# Altium schematic sheet interface.SchDoc (part 2 of 2)
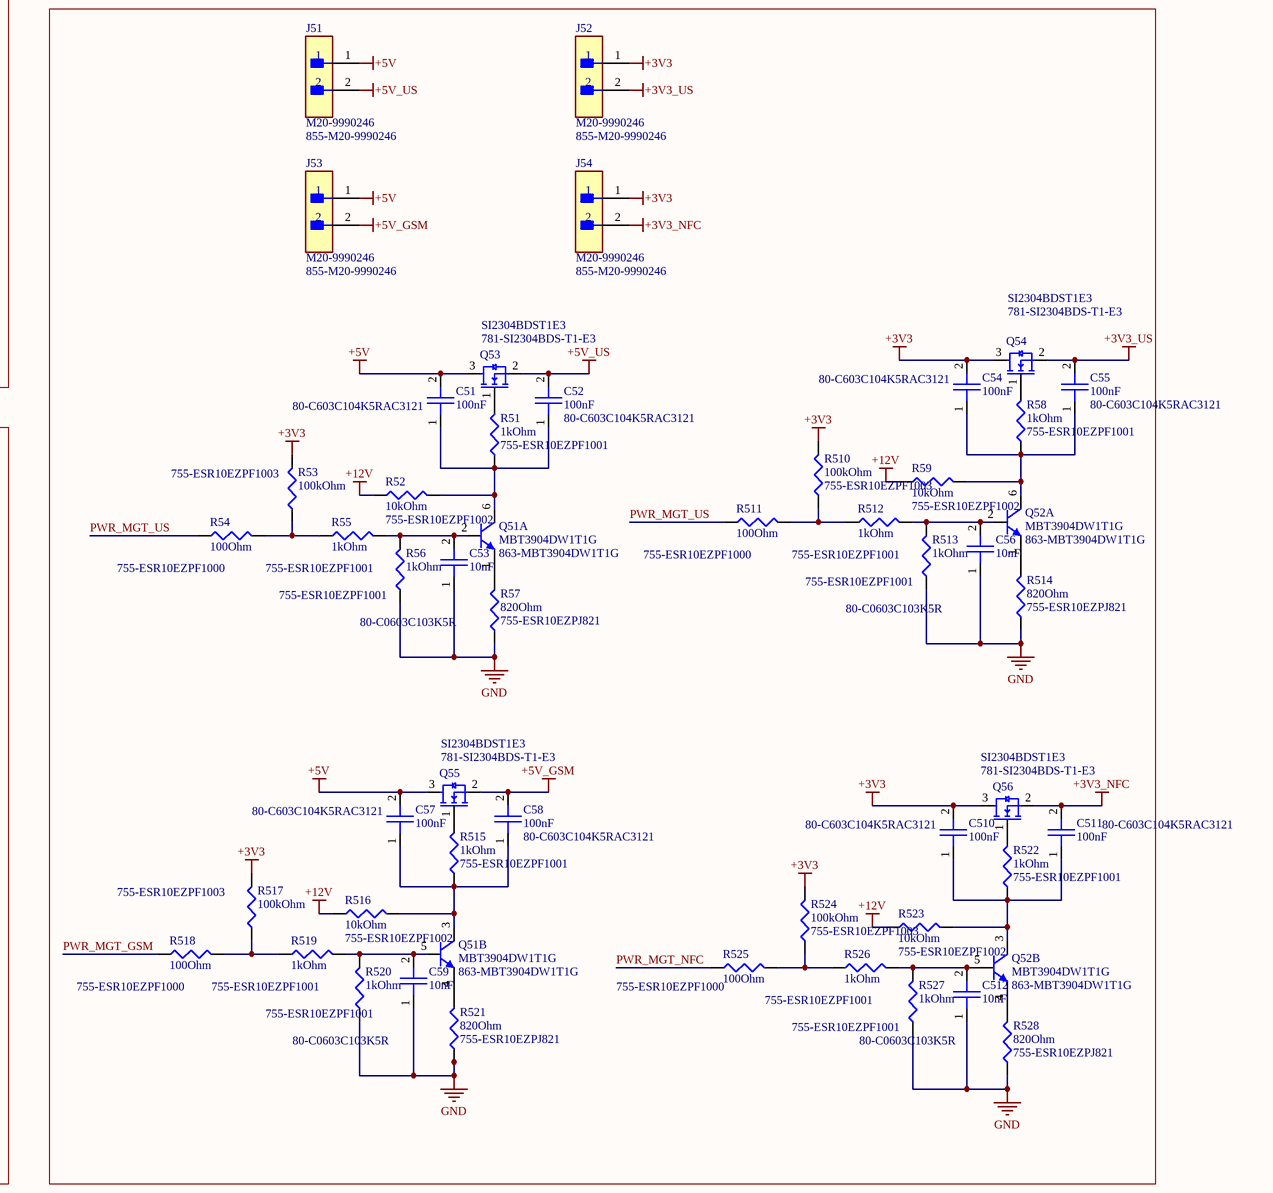
[diagram p4: interface.SchDoc, bottom right]

## Notes on the sheet
- (in symbol AP62301WU-7) GND; BST; SW; EN; VIN; FB
- (in symbol SN74LV1T02DBVRG4) A; B

## Library data of the parts
C11 C32 C53 C56 C59 C512 = C0603C103K5RACTU: CAP CER 10000PF 50V X7R 0603; Manufacturer: KEMET; Dielectric Material: Ceramic; Tolerance: 10%; Dissipation Factor: 2.5%; Supplier 1: Mouser; Manufacturer Part Number: C0603C103K5RACTU; RoHS: Yes; Category: Ceramic Capacitors; Stock 1: 1844699; Pricing 1: 1=0,16000, 10=0,07400, 50=0,07400, 100=0,03300, 500=0,02400, 1000=0,01900, 2000=0,01700, 4000=0,01500, 8000=0,01300, 10000=0,01300 (USD); Mount: Surface Mount,PCB; Case/Package: 0603; Number of Pins: 2; Case Code (Metric): 1608; Case Code (Imperial): 0603; Contact Plating: Tin,Matte; Min Operating Temperature: -55°C; Max Operating Temperature: 125°C; Capacitance: 10nF; Dielectric: X7R; Voltage Rating: 50V; Voltage Rating (DC): 50V; Packaging: Tape and Reel; Package Quantity: 4000; Termination: SMD/SMT; Voltage: 50V; Series: C0603C; Construction: Flat; Length: 1.6mm; Width: 0.8mm; Height: 0.8mm; Thickness: 0.034inch; Lead Pitch: 0.7mm; Depth: 0.8mm; Radiation Hardening: No; REACH SVHC: No SVHC; RoHS Compliant: Yes; ComponentLink1URL: https://datasheet.ciiva.com/7823/1732718-7823585.pdf?src-supplier=Element14; ComponentLink1Description: https://datasheet.ciiva.com/7823/1732718-7823585.pdf?src-supplier=Element14; ComponentLink2URL: https://datasheet.ciiva.com/5904/kem-c1002-x7r-smd-5904645.pdf?src-supplier=Farnell; ComponentLink2Description: https://datasheet.ciiva.com/5904/kem-c1002-x7r-smd-5904645.pdf?src-supplier=Farnell; ComponentLink3URL: https://datasheet.ciiva.com/7823/kem-c1002-x7r-smd-7823976.pdf?src-supplier=Element14; ComponentLink3Description: https://datasheet.ciiva.com/7823/kem-c1002-x7r-smd-7823976.pdf?src-supplier=Element14; ComponentLink4URL: https://datasheet.ciiva.com/7823/1918693-7823978.pdf?src-supplier=Element14; ComponentLink4Description: https://datasheet.ciiva.com/7823/1918693-7823978.pdf?src-supplier=Element14; ComponentLink5URL: https://datasheet.ciiva.com/28645/1851736-28645598.pdf?src-supplier=Element14; ComponentLink5Description: https://datasheet.ciiva.com/28645/1851736-28645598.pdf?src-supplier=Element14; ComponentLink6URL: https://datasheet.ciiva.com/7823/kem-c1002-x7r-smd-7823977.pdf?src-supplier=Element14; ComponentLink6Description: https://datasheet.ciiva.com/7823/kem-c1002-x7r-smd-7823977.pdf?src-supplier=Element14; ComponentLink7URL: https://datasheet.ciiva.com/14585/70095383-14585450.pdf?src-supplier=Allied+Electronics; ComponentLink7Description: https://datasheet.ciiva.com/14585/70095383-14585450.pdf?src-supplier=Allied+Electronics; ComponentLink8URL: https://datasheet.ciiva.com/5416/kem-c1002-x7r-smd-5416028.pdf?src-supplier=Mouser; ComponentLink8Description: https://datasheet.ciiva.com/5416/kem-c1002-x7r-smd-5416028.pdf?src-supplier=Mouser; ComponentLink9URL: https://datasheet.ciiva.com/39122/kem-c1002-x7r-smd-39122903.pdf?src-supplier=Onlinecomponents.com; ComponentLink9Description: https://datasheet.ciiva.com/39122/kem-c1002-x7r-smd-39122903.pdf?src-supplier=Onlinecomponents.com; ComponentLink10URL: https://datasheet.ciiva.com/18192/getdatasheetpartid-308803-18192662.pdf?src-supplier=Verical; ComponentLink10Description: https://datasheet.ciiva.com/18192/getdatasheetpartid-308803-18192662.pdf?src-supplier=Verical; ComponentLink11URL: https://datasheet.ciiva.com/18101/getdatasheetpartid-58468-18101898.pdf?src-supplier=Verical; ComponentLink11Description: https://datasheet.ciiva.com/18101/getdatasheetpartid-58468-18101898.pdf?src-supplier=Verical
C12 C21-C24 C33 C51 C52 C54 C55 C57 C58 C63 C510 C511 = C0603C104K5RAC3121: Cap Ceramic 0.1uF 50V X7R 10% Pad SMD 0603 125°C T/R; Manufacturer: KEMET; Supplier 1: Mouser; Manufacturer Part Number: C0603C104K5RAC3121; RoHS: Yes; Category: Ceramic Capacitors; Stock 1: 3306727; Pricing 1: 1=0,13000, 10=0,09200, 50=0,09200, 100=0,04300, 1000=0,02500, 10000=0,01900 (USD); Case/Package: 0603; RoHS Compliant: Yes
C13 C34 = C0603C105K4RACTU: Cap Ceramic 1uF 16V X7R 10% SMD 0603 125°C Paper T/R; Manufacturer: KEMET; Dissipation Factor: 3.5%; Supplier 1: Mouser; Manufacturer Part Number: C0603C105K4RACTU; RoHS: Yes; Category: Ceramic Capacitors; Stock 1: 3280807; Pricing 1: 1=0,17000, 10=0,08000, 50=0,08000, 100=0,03600, 500=0,02600, 1000=0,02000, 2000=0,01900, 4000=0,01600, 8000=0,01400, 10000=0,01400 (USD); Mount: Surface Mount,PCB; Case/Package: 0603; Number of Pins: 2; Case Code (Metric): 1608; Case Code (Imperial): 0603; Contact Plating: Tin,Matte; Dielectric Material: Ceramic; Min Operating Temperature: -55°C; Max Operating Temperature: 125°C; Package Quantity: 4000; Capacitance: 1uF; Voltage Rating: 16V; Tolerance: 10%; Packaging: Tape and Reel; Voltage Rating (DC): 16V; Dielectric: X7R; Termination: SMD/SMT; Voltage: 16V; Series: C0603C; Construction: Flat; Length: 1.6mm; Width: 0.031inch; Height: 0.8mm; Thickness: 0.034inch; Depth: 0.8mm; Radiation Hardening: No; REACH SVHC: No SVHC; RoHS Compliant: Yes; ComponentLink1URL: https://datasheet.ciiva.com/7823/kem-c1002-x7r-smd-7823997.pdf?src-supplier=Element14; ComponentLink1Description: https://datasheet.ciiva.com/7823/kem-c1002-x7r-smd-7823997.pdf?src-supplier=Element14; ComponentLink2URL: https://datasheet.ciiva.com/22749/kem-c1002-x7r-smd-22749721.pdf?src-supplier=Element14; ComponentLink2Description: https://datasheet.ciiva.com/22749/kem-c1002-x7r-smd-22749721.pdf?src-supplier=Element14; ComponentLink3URL: https://datasheet.ciiva.com/5419/kem-c1002-x7r-smd-5419750.pdf?src-supplier=Mouser; ComponentLink3Description: https://datasheet.ciiva.com/5419/kem-c1002-x7r-smd-5419750.pdf?src-supplier=Mouser; ComponentLink4URL: https://datasheet.ciiva.com/18192/getdatasheetpartid-385479-18192732.pdf?src-supplier=Verical; ComponentLink4Description: https://datasheet.ciiva.com/18192/getdatasheetpartid-385479-18192732.pdf?src-supplier=Verical
C31 = C0603C124K5RACTU: 0603 C 120nF Ceramic Multilayer Capacitor; 50 V; +125degC; X7R Dielec; +/-10%; Manufacturer: KEMET; Tolerance: 10%; Voltage Rating: 50V; Supplier 1: Mouser; Manufacturer Part Number: C0603C124K5RACTU; RoHS: Yes; Category: Ceramic Capacitors; Stock 1: 90207; Pricing 1: 1=0,37000, 10=0,18700, 50=0,18700, 100=0,15600, 500=0,11800, 1000=0,10300, 4000=0,09000, 8000=0,08200, 10000=0,08200, 12000=0,08100 (USD); Case/Package: 0603; Number of Pins: 2; Case Code (Metric): 1608; Case Code (Imperial): 0603; Dielectric Material: Ceramic; Min Operating Temperature: -55°C; Max Operating Temperature: 125°C; Packaging: Cut Tape; Capacitance: 120nF; Dielectric: X7R; Voltage: 50V; Termination: SMD/SMT; Voltage Rating (DC): 50V; Package Quantity: 1; Series: C; Construction: Flat; Length: 1.6mm; Width: 0.031inch; Height: 0.8mm; Depth: 0.8mm; Thickness: 0.034inch; Radiation Hardening: No; REACH SVHC: No SVHC; RoHS Compliant: Yes; ComponentLink1URL: https://datasheet.ciiva.com/7823/1633156-7823623.pdf?src-supplier=Element14; ComponentLink1Description: https://datasheet.ciiva.com/7823/1633156-7823623.pdf?src-supplier=Element14; ComponentLink2URL: https://datasheet.ciiva.com/22693/1851736-22693982.pdf?src-supplier=Element14; ComponentLink2Description: https://datasheet.ciiva.com/22693/1851736-22693982.pdf?src-supplier=Element14
C61 = EMK316BJ106KL8T: Capacitor Ceramic 10uF 16V X5R 10% SMD 1206 85°C Embossed T/R; Manufacturer: Taiyo Yuden; Manufacturer Part Number: EMK316BJ106KL8T; RoHS: Yes; Category: Ceramic Capacitors; Stock 1: 6028; Pricing 1: 1=0,42000, 10=0,29200, 50=0,29200, 100=0,17500, 1000=0,12800, 10000=0,09300 (USD); Supplier 1: Mouser
C621 C622 = EMK316BJ226KL-T: Cap Ceramic 22uF 16V X7R 10% SMD 0805 125°C Paper T/R; Manufacturer: Taiyo Yuden; Dielectric: X5R; Supplier 1: Mouser; Manufacturer Part Number: EMK316BJ226KL-T; RoHS: Yes; Category: Ceramic Capacitors; Stock 1: 61956; Pricing 1: 1=0,47000, 10=0,34700, 50=0,34700, 100=0,24600, 1000=0,17300, 10000=0,15000 (USD); Mount: Surface Mount; Case/Package: 1206; Case Code (Imperial): 1206; Case Code (Metric): 3216; Min Operating Temperature: -55°C; Max Operating Temperature: 85°C; Tolerance: 10%; Packaging: Tape and Reel; Voltage Rating: 16V; Capacitance: 22uF; Voltage Rating (DC): 16V; Package Quantity: 2000; Termination: SMD/SMT; Resistor Type: Ceramic; Series: M; Construction: Flat; Length: 0.126inch; Width: 1.6mm; Height: 1.6mm; Thickness: 0.071inch; RoHS Compliant: Yes; ComponentLink1URL: https://datasheet.ciiva.com/30123/emultilayer-ceramic-capacitor-30123646.pdf?src-supplier=Onlinecomponents.com; ComponentLink1Description: https://datasheet.ciiva.com/30123/emultilayer-ceramic-capacitor-30123646.pdf?src-supplier=Onlinecomponents.com
D1 D4 = LTST-C193TGKT-5A: 0603(H=0.35mm) 绿色 λD=520nm~535nm VR=5V VF=2.5V~3.1V IF=5mA PD=76mW; Manufacturer: Vishay Lite-On; Color: Green; Lens Color: Colorless; Forward Current: 5mA; Forward Voltage: 3.1V; Luminous Intensity: 280mcd; Viewing Angle: 130°; Lens Style: Diffused,Colorless,Rectangular; Lens Transparency: Clear; Dominant Wavelength: 535nm; Number of Elements: 1; Power Dissipation: 76mW; Reverse Voltage: 5V; Supplier 1: Mouser; Manufacturer Part Number: LTST-C193TGKT-5A; RoHS: Yes; Category: LEDs; Stock 1: 78292; Pricing 1: 1=0,44000, 10=0,27500, 50=0,27500, 100=0,15800, 1000=0,12400, 5000=0,11300, 10000=0,09600, 25000=0,09200, 50000=0,08900 (USD); Mount: Surface Mount; Case/Package: 0603; Number of Pins: 2; Case Code (Metric): 1608; Case Code (Imperial): 0603; Min Operating Temperature: -20°C; Max Operating Temperature: 80°C; Illumination Color: Green; Packaging: Tape and Reel; Package Quantity: 3000; Test Current: 5mA; Number of LEDs: 1; Series: -; Length: 1.6mm; Width: 0.8mm; Height: 0.35mm; Depth: 0.8mm; Radiation Hardening: No; Lead Free: Lead Free; RoHS Compliant: Yes; ComponentLink1URL: https://datasheet.ciiva.com/2111/ltst-c193tgkt-5a-2111818.pdf?src-supplier=Digi-Key; ComponentLink1Description: https://datasheet.ciiva.com/2111/ltst-c193tgkt-5a-2111818.pdf?src-supplier=Digi-Key; ComponentLink2URL: https://datasheet.ciiva.com/11775/0900766b80dc0555-11775617.pdf?src-supplier=RSComponents; ComponentLink2Description: https://datasheet.ciiva.com/11775/0900766b80dc0555-11775617.pdf?src-supplier=RSComponents; ComponentLink3URL: https://datasheet.ciiva.com/4689/lite-on-ltst-c193tgkt-5a-187259-4689610.pdf?src-supplier=Mouser; ComponentLink3Description: https://datasheet.ciiva.com/4689/lite-on-ltst-c193tgkt-5a-187259-4689610.pdf?src-supplier=Mouser; ComponentLink4URL: https://datasheet.ciiva.com/2111/p-100-ltst-c193tgkt-5a-2111819.pdf?src-supplier=Digi-Key; ComponentLink4Description: https://datasheet.ciiva.com/2111/p-100-ltst-c193tgkt-5a-2111819.pdf?src-supplier=Digi-Key; ComponentLink5URL: https://datasheet.ciiva.com/2111/p-100-ltst-c193tgkt-5a-2111820.pdf?src-supplier=Digi-Key; ComponentLink5Description: https://datasheet.ciiva.com/2111/p-100-ltst-c193tgkt-5a-2111820.pdf?src-supplier=Digi-Key
D2 = LTST-C193TBKT-5A: 0603(H=0.35mm) 蓝色 λD=465nm~475nm VR=5V VF=2.65V~3.05V IF=5mA PD=76mW; Manufacturer: Vishay Lite-On; Color: Blue; Lens Color: Colorless; Forward Current: 20mA; Forward Voltage: 2.8V; Luminous Intensity: 15mcd; Viewing Angle: 130°; Lens Style: Diffused,Colorless,Rectangular,Clear; Dominant Wavelength: 475nm; Test Current: 5mA; Lens Transparency: Clear; Number of Elements: 1; Power Dissipation: 76mW; Reverse Voltage: 5V; Supplier 1: Mouser; Manufacturer Part Number: LTST-C193TBKT-5A; RoHS: Yes; Category: LEDs; Stock 1: 327691; Pricing 1: 1=0,30000, 10=0,23400, 50=0,23400, 100=0,10600, 500=0,09500, 1000=0,07800, 5000=0,06700, 10000=0,05400, 25000=0,05000, 50000=0,04500 (USD); Mount: Surface Mount; Case/Package: 0603; Number of Pins: 2; Case Code (Metric): 1608; Case Code (Imperial): 0603; Min Operating Temperature: -20°C; Max Operating Temperature: 80°C; Illumination Color: Blue; Packaging: Tape and Reel; Package Quantity: 1; Number of LEDs: 1; Length: 1.6mm; Width: 0.8mm; Height: 0.35mm; Depth: 0.8mm; Radiation Hardening: No; RoHS Compliant: Yes; Lead Free: Lead Free; ComponentLink1URL: https://datasheet.ciiva.com/2111/ltst-c193tbkt-5a-2111219.pdf?src-supplier=Digi-Key; ComponentLink1Description: https://datasheet.ciiva.com/2111/ltst-c193tbkt-5a-2111219.pdf?src-supplier=Digi-Key; ComponentLink2URL: https://datasheet.ciiva.com/11773/0900766b80dc0554-11773880.pdf?src-supplier=RSComponents; ComponentLink2Description: https://datasheet.ciiva.com/11773/0900766b80dc0554-11773880.pdf?src-supplier=RSComponents; ComponentLink3URL: https://datasheet.ciiva.com/4688/lite-on-ltst-c193tbkt-5a-187386-4688832.pdf?src-supplier=Mouser; ComponentLink3Description: https://datasheet.ciiva.com/4688/lite-on-ltst-c193tbkt-5a-187386-4688832.pdf?src-supplier=Mouser; ComponentLink4URL: https://datasheet.ciiva.com/16210/ltst-c193tbkt-5a-16210824.pdf?src-supplier=Future+Electronics; ComponentLink4Description: https://datasheet.ciiva.com/16210/ltst-c193tbkt-5a-16210824.pdf?src-supplier=Future+Electronics; ComponentLink5URL: https://datasheet.ciiva.com/15201/getdatasheetpartid-293056-15201395.pdf?src-supplier=Verical; ComponentLink5Description: https://datasheet.ciiva.com/15201/getdatasheetpartid-293056-15201395.pdf?src-supplier=Verical; ComponentLink6URL: https://datasheet.ciiva.com/2111/p-100-ltst-c193tbkt-5a-2111220.pdf?src-supplier=Digi-Key; ComponentLink6Description: https://datasheet.ciiva.com/2111/p-100-ltst-c193tbkt-5a-2111220.pdf?src-supplier=Digi-Key; ComponentLink7URL: https://datasheet.ciiva.com/2111/p-100-ltst-c193tbkt-5a-2111221.pdf?src-supplier=Digi-Key; ComponentLink7Description: https://datasheet.ciiva.com/2111/p-100-ltst-c193tbkt-5a-2111221.pdf?src-supplier=Digi-Key
D3 = LTST-C191KRKT: 0603(H=0.65mm) 红色 λD=631nm VR=5V VF=2.0V~2.4V IF=20mA PD=75mW; Manufacturer: Vishay Lite-On; Color: Red; Lens Color: Colorless; Luminous Intensity: 54mcd; Viewing Angle: 130°; Forward Current: 30mA; Forward Voltage: 2V; Lens Style: Clear,Diffused,Colorless,Rectangular; Dominant Wavelength: 631nm; Test Current: 20mA; Lens Transparency: Clear; Number of Elements: 1; Power Dissipation: 75mW; Wavelength: 639nm; Reverse Voltage: 5V; Supplier 1: Mouser; Manufacturer Part Number: LTST-C191KRKT; RoHS: Yes; Category: LEDs; Stock 1: 594160; Pricing 1: 1=0,26000, 10=0,14200, 50=0,14200, 100=0,06600, 500=0,06100, 1000=0,04800, 5000=0,04600, 10000=0,03600, 25000=0,03200, 50000=0,02900 (USD); Mount: Surface Mount; Case/Package: 0603; Number of Pins: 2; Case Code (Metric): 1608; Case Code (Imperial): 0603; Min Operating Temperature: -55°C; Max Operating Temperature: 85°C; Packaging: Tape and Reel; Package Quantity: 1; Illumination Color: Red; Number of LEDs: 1; Power Rating: 75mW; Length: 1.6mm; Width: 0.8mm; Height: 0.55mm; Depth: 0.8mm; Radiation Hardening: No; RoHS Compliant: Yes; Lead Free: Lead Free; ComponentLink1URL: https://datasheet.ciiva.com/11773/0900766b80dc02b2-11773601.pdf?src-supplier=RSComponents; ComponentLink1Description: https://datasheet.ciiva.com/11773/0900766b80dc02b2-11773601.pdf?src-supplier=RSComponents; ComponentLink2URL: https://datasheet.ciiva.com/12400/lite-on-ltst-c191krkt-190135-12400910.pdf?src-supplier=Mouser; ComponentLink2Description: https://datasheet.ciiva.com/12400/lite-on-ltst-c191krkt-190135-12400910.pdf?src-supplier=Mouser; ComponentLink3URL: https://datasheet.ciiva.com/16212/ltst-c191krkt-16212419.pdf?src-supplier=Future+Electronics; ComponentLink3Description: https://datasheet.ciiva.com/16212/ltst-c191krkt-16212419.pdf?src-supplier=Future+Electronics; ComponentLink4URL: https://datasheet.ciiva.com/15117/getdatasheetpartid-141922-15117737.pdf?src-supplier=Verical; ComponentLink4Description: https://datasheet.ciiva.com/15117/getdatasheetpartid-141922-15117737.pdf?src-supplier=Verical; ComponentLink5URL: https://datasheet.ciiva.com/2109/s-110-ltst-c191krkt-2109971.pdf?src-supplier=Digi-Key; ComponentLink5Description: https://datasheet.ciiva.com/2109/s-110-ltst-c191krkt-2109971.pdf?src-supplier=Digi-Key; ComponentLink6URL: https://datasheet.ciiva.com/2109/s-110-ltst-c191krkt-2109970.pdf?src-supplier=Digi-Key; ComponentLink6Description: https://datasheet.ciiva.com/2109/s-110-ltst-c191krkt-2109970.pdf?src-supplier=Digi-Key; ComponentLink7URL: https://datasheet.ciiva.com/2109/s-110-ltst-c191krkt-2109972.pdf?src-supplier=Digi-Key; ComponentLink7Description: https://datasheet.ciiva.com/2109/s-110-ltst-c191krkt-2109972.pdf?src-supplier=Digi-Key; Voltage: 2V
J01 = CON-SOCJ-2155: DC Power Connectors Power Jack/Connector 2.1mm x 5.5mm; Manufacturer: Gravitech; Supplier 1: Mouser; Manufacturer Part Number: CON-SOCJ-2155; RoHS: Yes; Category: Uncategorized; Stock 1: 14426; Pricing 1: 1=1,00000, 10=1,00000, 50=1,00000, 100=1,00000, 1000=1,00000, 10000=1,00000 (USD); Color: Black; Connector Type: Power; Contact Gender: Female; ComponentLink1URL: http://www.gravitech.us/poja2x51.html?src-supplier=Mouser; ComponentLink1Description: http://www.gravitech.us/poja2x51.html?src-supplier=Mouser
J11 J12 = TFM-110-21-S-D: SAMTEC         TFM-110-21-S-D             Board-To-Board Connector, TFM Series, 20 Contacts, Header, 1.27 mm, Through Hole, 2 Rows; Max Current Rating: 5A; Number of Contacts: 20; Max Voltage Rating (AC): 350V; Gender: Male; Pitch: 1.27mm; Supplier 1: Mouser; Manufacturer: Samtec; Manufacturer Part Number: TFM-110-21-S-D; RoHS: Yes; Category: Connectors; Stock 1: 11; Pricing 1: 1=7,99000, 10=7,65000, 50=7,65000, 100=7,65000, 1000=5,32000, 10000=4,66000 (USD); Housing Color: Black; Housing Material: Polymer; Contact Plating: Gold; Contact Material: Bronze; Min Operating Temperature: -55°C; Max Operating Temperature: 125°C; Packaging: Rail/Tube; Number of Rows: 2; Termination: Solder; Orientation: Straight; Length: 15.88mm; Depth: 5.72mm; REACH SVHC: No SVHC; RoHS Compliant: Yes; ComponentLink1URL: http://www.farnell.com/datasheets/2047776.pdf?src-supplier=Farnell; ComponentLink1Description: http://www.farnell.com/datasheets/2047776.pdf?src-supplier=Farnell; ComponentLink2URL: http://www.samtec.com/documents/webfiles/pdf/TFM_SM.PDF?src-supplier=Avnet; ComponentLink2Description: http://www.samtec.com/documents/webfiles/pdf/TFM_SM.PDF?src-supplier=Avnet
J13 = PPTC071LFBN-RC: Female, 7C, Straight, .100"CC; 3.20mm Tail, No Mt. 100u" Tin; PBT, Phos Bronze, 105 C; Manufacturer: Sullins; Number of Positions: 7; Connector Type: Header,Socket; Pitch: 0.1inch; Supplier 1: Digi-Key; Manufacturer Part Number: PPTC071LFBN-RC; RoHS: Yes; Category: Connectors; Stock 1: 23266; Pricing 1: 1=0,59000, 10=0,51500, 80=0,42438, 440=0,36900, 1000=0,30442, 5000=0,26752, 10000=0,26650 (USD); Mount: Through Hole; Contact Material: Bronze; Contact Plating: Tin; Color: Black; Housing Material: Plastic; Termination: Solder; Package Quantity: 1000; Number of Rows: 1; Packaging: Bulk; Length: 18.3mm; Width: 2.5mm; Height: 8.5mm; Lead Free: Lead Free; ComponentLink1URL: https://media.digikey.com/pdf/Data%20Sheets/Sullins%20PDFs/Female_Headers.100_DS.pdf?src-supplier=Digi-Key; ComponentLink1Description: https://media.digikey.com/pdf/Data%20Sheets/Sullins%20PDFs/Female_Headers.100_DS.pdf?src-supplier=Digi-Key; ComponentLink2URL: http://www.sullinscorp.com/catalogs/78_Page80-81_HEADER_.100_2.54mm_FEMALE.pdf?src-supplier=Future+Electronics; ComponentLink2Description: http://www.sullinscorp.com/catalogs/78_Page80-81_HEADER_.100_2.54mm_FEMALE.pdf?src-supplier=Future+Electronics
J14 J26 J34 = 61301221021: THT Angled Pin Header WR-PHD, Pitch 2.54 mm, Dual Row, 12 pins; Manufacturer: Wurth Elektronik; Pitch: 2.54mm; Gender: Male; Pin Number: 12; Working Voltage: 250VAC; Withstanding Voltage: 500VAC; Contact Resistance: 20mOhm; Rated Current: 3A; Datasheet URL: https://katalog.we-online.de/em/datasheet/6130xx21021.pdf; Orientation: Angled; Package Reference: 61301221021; Operating Temperature: -40to105degC; Part Number: 61301221021; Mounting Technology: THT; Row Number: Dual; Publisher: WurthElektronik; Packaging: Bag; Manufacturer URL: http://www.we-online.de; Supplier 1: Mouser
J21-J25 J33 = PPPC041LFBN-RC: 4 Positions Embase Connecteur 0,100 po (2,54mm) Trou traversant Or; Manufacturer: Sullins; Number of Positions: 4; Pitch: 0.1inch; Supplier 1: Digi-Key; Manufacturer Part Number: PPPC041LFBN-RC; RoHS: Yes; Category: Connectors; Stock 1: 100451; Pricing 1: 1=0,47000, 10=0,40700, 100=0,33530, 500=0,29160, 1000=0,24057, 5000=0,21141, 10000=0,21060 (USD); Mount: Through Hole; Color: Black; Contact Plating: Gold; Contact Material: Bronze; Housing Material: Plastic; Package Quantity: 1000; Number of Rows: 1; Packaging: Bulk; Termination: Solder; Connector Type: Header; Contact Type: Female Socket; Length: 10.7mm; Width: 2.5mm; Height: 8.5mm; Lead Free: Lead Free; RoHS Compliant: Yes; ComponentLink1URL: https://media.digikey.com/pdf/Data%20Sheets/Sullins%20PDFs/Female_Headers.100_DS.pdf?src-supplier=Digi-Key; ComponentLink1Description: https://media.digikey.com/pdf/Data%20Sheets/Sullins%20PDFs/Female_Headers.100_DS.pdf?src-supplier=Digi-Key; ComponentLink2URL: http://www.sullinscorp.com/catalogs/78_Page80-81_HEADER_.100_2.54mm_FEMALE.pdf?src-supplier=Future+Electronics; ComponentLink2Description: http://www.sullinscorp.com/catalogs/78_Page80-81_HEADER_.100_2.54mm_FEMALE.pdf?src-supplier=Future+Electronics
J31 = PPTC061LFBN-RC: Female, 6 C, Straight, .100"CC; 3.20mm Tail, No Mt. 100u" Tin; PBT, Phos Bronze, 105 C; Manufacturer: Sullins; Supplier 1: Digi-Key; Manufacturer Part Number: PPTC061LFBN-RC; RoHS: Yes; Category: Connectors; Stock 1: 131305; Pricing 1: 1=0,52000, 10=0,44900, 80=0,37050, 440=0,32220, 1000=0,26582, 5000=0,23360, 10000=0,23270 (USD); ComponentLink1URL: https://media.digikey.com/pdf/Data%20Sheets/Sullins%20PDFs/Female_Headers.100_DS.pdf?src-supplier=Digi-Key; ComponentLink1Description: https://media.digikey.com/pdf/Data%20Sheets/Sullins%20PDFs/Female_Headers.100_DS.pdf?src-supplier=Digi-Key; ComponentLink2URL: http://www.sullinscorp.com/catalogs/78_Page80-81_HEADER_.100_2.54mm_FEMALE.pdf?src-supplier=Future+Electronics; ComponentLink2Description: http://www.sullinscorp.com/catalogs/78_Page80-81_HEADER_.100_2.54mm_FEMALE.pdf?src-supplier=Future+Electronics
J32 = 110990030: Grove - Universal 4 pin connector [Seeed Studio] 110990030 Grove - Universal 4 pin connector; Supplier 1: Digi-Key; Manufacturer: Seeed Studio; Manufacturer Part Number: 110990030; RoHS: No; Category: Connectors; Stock 1: 3588; Pricing 1: 1=1,70000 (USD); ComponentLink1URL: http://www.mouser.com/ds/2/744/Seeed_316010005-786598.pdf?src-supplier=Mouser; ComponentLink1Description: http://www.mouser.com/ds/2/744/Seeed_316010005-786598.pdf?src-supplier=Mouser; ComponentLink2URL: https://statics3.seeedstudio.com/images/opl/datasheet/3470130P1.pdf?src-supplier=Digi-Key; ComponentLink2Description: https://statics3.seeedstudio.com/images/opl/datasheet/3470130P1.pdf?src-supplier=Digi-Key
J51-J54 = M20-9990246: 2.54mm (0.1") Pitch SIL Vertical PC Tail Pin Header, 6.1mm mating pin height, tin, 2 contacts; Manufacturer: Harwin; Number of Contacts: 2; Current Rating: 3A; Contact Resistance: 30mR; Gender: Male; Insulation Resistance: 10GR; Voltage Rating (AC): 750V; Connector Type: Male Pin; Supplier 1: Mouser; Manufacturer Part Number: M20-9990246; RoHS: Yes; Category: Headers and Wire Housings; Stock 1: 121083; Pricing 1: 1=0,17000, 10=0,08400, 50=0,08400, 100=0,07000, 500=0,06300, 1000=0,05400, 2000=0,04600, 10000=0,04500, 25000=0,03700, 50000=0,03500 (USD); Mount: Through Hole; Case/Package: SIL; Contact Plating: Tin; Color: Black; Contact Material: Brass,Bronze; Housing Color: Black; Housing Material: Nylon; Min Operating Temperature: -40°C; Max Operating Temperature: 105°C; Number of Rows: 1; Termination: Solder; Package Quantity: 1000; Packaging: Bulk; Max Current Rating: 3A; Number of Positions: 2; Orientation: Straight; Length: 5.08mm; Pitch: 2.54mm; Contact Mating Length: 0.24inch; Depth: 2.54mm; Radiation Hardening: No; REACH SVHC: No SVHC; ComponentLink1URL: https://datasheet.ciiva.com/8046/315376-8046930.pdf?src-supplier=Element14; ComponentLink1Description: https://datasheet.ciiva.com/8046/315376-8046930.pdf?src-supplier=Element14; ComponentLink2URL: https://datasheet.ciiva.com/11745/0900766b81034e61-11745755.pdf?src-supplier=RSComponents; ComponentLink2Description: https://datasheet.ciiva.com/11745/0900766b81034e61-11745755.pdf?src-supplier=RSComponents; ComponentLink3URL: https://datasheet.ciiva.com/22660/1830818-22660571.pdf?src-supplier=Element14; ComponentLink3Description: https://datasheet.ciiva.com/22660/1830818-22660571.pdf?src-supplier=Element14; ComponentLink4URL: https://datasheet.ciiva.com/6833/m20-999-6833368.pdf?src-supplier=Digi-Key; ComponentLink4Description: https://datasheet.ciiva.com/6833/m20-999-6833368.pdf?src-supplier=Digi-Key; ComponentLink5URL: https://datasheet.ciiva.com/26852/getdatasheetpartid-384170-26852203.pdf?src-supplier=Verical; ComponentLink5Description: https://datasheet.ciiva.com/26852/getdatasheetpartid-384170-26852203.pdf?src-supplier=Verical
L61 = SRP7020TA-3R3M: Inductor Power Shielded Wirewound 3.3uH 20% 100KHz 15Q-Factor Metal Alloy Powder 5A 0.048Ohm DCR T/R; Manufacturer: Bourns; Supplier 1: Mouser; Manufacturer Part Number: SRP7020TA-3R3M; RoHS: No; Stock 1: 2936; Pricing 1: 1=1,46000, 10=1,09000, 50=1,09000, 100=0,98300, 250=0,87800, 500=0,75300, 1000=0,66900, 1500=0,64200, 3000=0,59800, 9000=0,56900, 10000=0,56900 (USD)
Q41-Q43 = NXV55UNR: Transistor MOSFET N-Channel 30V 2.3A 3-Pin SOT-23; Manufacturer: Nexperia; Supplier 1: Mouser; Manufacturer Part Number: NXV55UNR; RoHS: No; Stock 1: 55565; Pricing 1: 1=0,45000, 10=0,34400, 50=0,34400, 100=0,19500, 1000=0,09900, 10000=0,06800 (USD)
Q51 Q52 = CMP-1048-00877-1: Dual General Purpose Transistors, 6-Pin SOT-363, Pb-Free, Tape and Reel; Manufacturer: On Semiconductor; Polarity: Dual NPN; fT Min (MHz): 300; IC Continuous (A): 0.2; DatasheetVersion: Rev. 9; ComponentLink2Description: Datasheet; Mounting Technology: Surface Mount; PackageReference: SOT-363-6-419B-02_W; RoHS: TRUE; ComponentLink1Description: Manufacturer URL; ComponentLink2URL: http://www.onsemi.com/pub_link/Collateral/MBT3904DW1T1-D.PDF; PackageVersion: Rev. W, 01/2006; Packing: Tape and Reel; PartNumber: MBT3904DW1T1G; ComponentLink1URL: http://www.onsemi.com/; ComponentLink3URL: http://www.onsemi.com/pub_link/Collateral/NTJD4001N-D.PDF; ComponentLink3Description: Package Specification; PackageDescription: 6-Pin Small Outline Transistor, Body 2 x 1.25 mm, Pitch 0.65 mm; Supplier 1: Mouser
Q53-Q56 = SI2304BDST1E3: Single N-Channel 30 V 0.07 Ohms Surface Mount Power Mosfet - SOT-23; Manufacturer: Vishay; On-State Resistance: 70mR; Rise Time: 12.5ns; Nominal Vgs: 1.5V; Input Capacitance: 225pF; Number of Channels: 1; Max Power Dissipation: 750mW; Drain to Source Voltage (Vdss): 30V; Continuous Drain Current (ID): 2.6A; Gate to Source Voltage (Vgs): 20V; Turn-Off Delay Time: 19ns; Turn-On Delay Time: 7.5ns; Supplier 1: Mouser; Manufacturer Part Number: SI2304BDST1E3; RoHS: Yes; Category: MOSFETs; Stock 1: 13203; Pricing 1: 1=0,67000, 10=0,57800, 50=0,57800, 100=0,43200, 500=0,33900, 1000=0,26200, 3000=0,23800, 10000=0,23800 (USD); Mount: Surface Mount; Case/Package: SOT-23; Number of Pins: 3; Weight: 0.050717oz; Min Operating Temperature: -55°C; Max Operating Temperature: 150°C; Element Configuration: Single; Packaging: Tape and Reel; Package Quantity: 1; Rds On Max: 70mR; Number of Elements: 1; Drain to Source Breakdown Voltage: 30V; Drain to Source Resistance: 70mR; Fall Time: 12.5ns; Threshold Voltage: 1.5V; Power Dissipation: 750mW; Length: 3.04mm; Width: 1.4mm; Height: 1.02mm; Radiation Hardening: No; REACH SVHC: Unknown; Lead Free: Lead Free; ComponentLink1URL: https://datasheet.ciiva.com/16225/si2304bds-16225072.pdf?src-supplier=Future+Electronics; ComponentLink1Description: https://datasheet.ciiva.com/16225/si2304bds-16225072.pdf?src-supplier=Future+Electronics; ComponentLink2URL: https://datasheet.ciiva.com/22707/1674170-22707810.pdf?src-supplier=Element14; ComponentLink2Description: https://datasheet.ciiva.com/22707/1674170-22707810.pdf?src-supplier=Element14; ComponentLink3URL: https://datasheet.ciiva.com/4439/si2304bds-107231-4439578.pdf?src-supplier=Mouser; ComponentLink3Description: https://datasheet.ciiva.com/4439/si2304bds-107231-4439578.pdf?src-supplier=Mouser; ComponentLink4URL: https://datasheet.ciiva.com/11161/si2304bds-11161450.pdf?src-supplier=Avnet; ComponentLink4Description: https://datasheet.ciiva.com/11161/si2304bds-11161450.pdf?src-supplier=Avnet; ComponentLink5URL: https://datasheet.ciiva.com/6367/si2304bds-6367035.pdf?src-supplier=Digi-Key; ComponentLink5Description: https://datasheet.ciiva.com/6367/si2304bds-6367035.pdf?src-supplier=Digi-Key; ComponentLink6URL: https://datasheet.ciiva.com/46386/1912647-46386540.pdf?src-supplier=Element14; ComponentLink6Description: https://datasheet.ciiva.com/46386/1912647-46386540.pdf?src-supplier=Element14; ComponentLink7URL: https://datasheet.ciiva.com/6367/si2304bds-6367038.pdf?src-supplier=Digi-Key; ComponentLink7Description: https://datasheet.ciiva.com/6367/si2304bds-6367038.pdf?src-supplier=Digi-Key
R21-R25 R45-R47 R54 R511 R518 R525 = ESR10EZPF1000: Res Thick Film 0805 100 Ohm 1% 2/5W ±100ppm/°C Molded SMD Paper T/R; Manufacturer: Rohm; Resistance: 100R; Max Power Dissipation: 400mW; Supplier 1: Mouser; Manufacturer Part Number: ESR10EZPF1000; RoHS: Yes; Category: Chip SMD Resistors; Stock 1: 17116; Pricing 1: 1=0,18000, 10=0,15300, 50=0,15300, 100=0,06000, 1000=0,02600, 10000=0,02000 (USD); Case/Package: 0805; Case Code (Imperial): 0805; Case Code (Metric): 2012; Min Operating Temperature: -55°C; Max Operating Temperature: 155°C; Resistor Type: Thick Film; Packaging: Tape and Reel; Tolerance: 1%; Temperature Coefficient: 100ppm/°C; Features: Automotive AEC-Q200; Number of Terminations: 2; Series: ESR; RoHS Compliant: Yes; ComponentLink1URL: http://www.farnell.com/datasheets/2611941.pdf?src-supplier=Farnell; ComponentLink1Description: http://www.farnell.com/datasheets/2611941.pdf?src-supplier=Farnell; ComponentLink2URL: https://www.rohm.com/datasheet/ESR01MZPF/esr-e?src-supplier=Digi-Key; ComponentLink2Description: https://www.rohm.com/datasheet/ESR01MZPF/esr-e?src-supplier=Digi-Key; ComponentLink3URL: http://www.farnell.com/datasheets/2611941.pdf?src-supplier=Newark; ComponentLink3Description: http://www.farnell.com/datasheets/2611941.pdf?src-supplier=Newark; ComponentLink4URL: http://rohmfs.rohm.com/en/products/databook/datasheet/passive/resistor/chip_resistor/esr.pdf?src-supplier=Avnet; ComponentLink4Description: http://rohmfs.rohm.com/en/products/databook/datasheet/passive/resistor/chip_resistor/esr.pdf?src-supplier=Avnet
R31 = ESR10EZPJ823: Res Anti-surge 0805 82K Ohm 0.4W 5% SMD; Manufacturer: Rohm; Resistance: 82kR; Temperature Coefficient: 200ppm/°C; Max Power Dissipation: 400mW; Supplier 1: Mouser; Manufacturer Part Number: ESR10EZPJ823; RoHS: Yes; Category: Chip SMD Resistors; Stock 1: 11137; Pricing 1: 1=0,10000, 10=0,08600, 50=0,08600, 100=0,03300, 1000=0,01500, 10000=0,01100 (USD); Case/Package: 0805; Min Operating Temperature: -55°C; Max Operating Temperature: 155°C; Packaging: Tape and Reel; Tolerance: 5%; Features: Automotive AEC-Q200; Number of Terminations: 2; Series: ESR; RoHS Compliant: Yes; ComponentLink1URL: https://www.rohm.com/datasheet/ESR01MZPF/esr-e?src-supplier=Digi-Key; ComponentLink1Description: https://www.rohm.com/datasheet/ESR01MZPF/esr-e?src-supplier=Digi-Key; Case Code (Imperial): 0805; Case Code (Metric): 2012; Length: 2mm; Width: 1.25mm; Height: 0.55mm
R32 = ESR10EZPF2002: Res Thick Film 0805 20KOhm 1% 2/5W ±100ppm/°C Molded SMD Paper T/R; Manufacturer: Rohm; Resistance: 20kR; Max Power Dissipation: 400mW; Supplier 1: Mouser; Manufacturer Part Number: ESR10EZPF2002; RoHS: Yes; Category: Chip SMD Resistors; Stock 1: 3687; Pricing 1: 1=0,18000, 10=0,15300, 50=0,15300, 100=0,06000, 1000=0,02600, 10000=0,02000 (USD); Case/Package: 0805; Min Operating Temperature: -55°C; Max Operating Temperature: 155°C; Packaging: Tape and Reel; Tolerance: 1%; Resistor Type: Thick Film; Temperature Coefficient: 100ppm/°C; Package Quantity: 5000; Number of Terminations: 2; Features: Automotive AEC-Q200; Series: ESR10; Length: 0.079inch; Width: 0.049inch; Height: 0.026inch; RoHS Compliant: Yes; ComponentLink1URL: http://rohmfs.rohm.com/en/products/databook/datasheet/passive/resistor/chip_resistor/esr.pdf?src-supplier=Avnet; ComponentLink1Description: http://rohmfs.rohm.com/en/products/databook/datasheet/passive/resistor/chip_resistor/esr.pdf?src-supplier=Avnet; ComponentLink2URL: http://www.rohm.com/web/global/datasheet/ESR01MZPF/esr-e?src-supplier=Digi-Key; ComponentLink2Description: http://www.rohm.com/web/global/datasheet/ESR01MZPF/esr-e?src-supplier=Digi-Key
R41 R42 R44 = ESR10EZPJ391: Res Thick Film 0805 390 Ohm 5% 0.4W ±200ppm/C Pad SMD Automotive T/R; Manufacturer: Rohm; Resistance: 390R; Temperature Coefficient: 200ppm/°C; Max Power Dissipation: 400mW; Supplier 1: Mouser; Manufacturer Part Number: ESR10EZPJ391; RoHS: Yes; Category: Chip SMD Resistors; Stock 1: 14695; Pricing 1: 1=0,10000, 10=0,08600, 50=0,08600, 100=0,03300, 1000=0,01500, 10000=0,01100 (USD); Case/Package: 0805; Case Code (Metric): 2012; Case Code (Imperial): 0805; Min Operating Temperature: -55°C; Max Operating Temperature: 155°C; Tolerance: 5%; Package Quantity: 1; Packaging: Tape and Reel; Resistor Type: Thick Film; Number of Terminations: 2; Features: Automotive AEC-Q200; Series: ESR; Length: 0.079inch; Width: 0.049inch; Height: 0.026inch; RoHS Compliant: Yes; ComponentLink1URL: https://datasheet.ciiva.com/2525/esr-2525659.pdf?src-supplier=Digi-Key; ComponentLink1Description: https://datasheet.ciiva.com/2525/esr-2525659.pdf?src-supplier=Digi-Key; ComponentLink2URL: https://datasheet.ciiva.com/2525/esr-2525660.pdf?src-supplier=Digi-Key; ComponentLink2Description: https://datasheet.ciiva.com/2525/esr-2525660.pdf?src-supplier=Digi-Key; ComponentLink3URL: https://datasheet.ciiva.com/2525/esr-2525661.pdf?src-supplier=Digi-Key; ComponentLink3Description: https://datasheet.ciiva.com/2525/esr-2525661.pdf?src-supplier=Digi-Key
R43 = ESR10EZPJ621: Res Thick Film 0805 620 Ohm 5% 0.4W ±200ppm/C Pad SMD Automotive T/R; Manufacturer: Rohm; Resistance: 620R; Max Power Dissipation: 400mW; Temperature Coefficient: 200ppm/°C; Supplier 1: Mouser; Manufacturer Part Number: ESR10EZPJ621; RoHS: Yes; Category: Chip SMD Resistors; Stock 1: 24071; Pricing 1: 1=0,10000, 10=0,08600, 50=0,08600, 100=0,03300, 1000=0,01500, 2500=0,01300, 5000=0,01100, 10000=0,01100 (USD); Case/Package: 0805; Case Code (Metric): 2012; Case Code (Imperial): 0805; Min Operating Temperature: -55°C; Max Operating Temperature: 155°C; Package Quantity: 5000; Packaging: Tape and Reel; Tolerance: 5%; Resistor Type: Thick Film; Number of Terminations: 2; Features: Automotive AEC-Q200; Series: ESR; Length: 0.079inch; Width: 0.049inch; Height: 0.026inch; RoHS Compliant: Yes; ComponentLink1URL: https://datasheet.ciiva.com/14925/esr-14925654.pdf?src-supplier=Digi-Key; ComponentLink1Description: https://datasheet.ciiva.com/14925/esr-14925654.pdf?src-supplier=Digi-Key; ComponentLink2URL: https://datasheet.ciiva.com/14932/esr-14932253.pdf?src-supplier=Digi-Key; ComponentLink2Description: https://datasheet.ciiva.com/14932/esr-14932253.pdf?src-supplier=Digi-Key
R51 R55 R56 R58 R512 R513 R515 R519 R520 R522 R526 R527 = ESR10EZPF1001: Res Thick Film 0805 1K Ohm 1% 0.4W ±100ppm/C Epoxy Resin Pad SMD Automotive T/R; Manufacturer: Rohm; Resistance: 1kR; Temperature Coefficient: 100ppm/°C; Power Rating: 400mW; Supplier 1: Mouser; Manufacturer Part Number: ESR10EZPF1001; RoHS: Yes; Category: Chip SMD Resistors; Stock 1: 27313; Pricing 1: 1=0,18000, 10=0,15300, 50=0,15300, 100=0,06000, 1000=0,02600, 10000=0,02000 (USD); Case/Package: 0805; Case Code (Metric): 2012; Case Code (Imperial): 0805; Size Code: 0805; Min Operating Temperature: -55°C; Max Operating Temperature: 155°C; Tolerance: 1%; Packaging: Tape and Reel; Resistor Type: Thick Film; Package Quantity: 1; Number of Terminations: 2; Max Power Dissipation: 400mW; Features: Automotive AEC-Q200; Series: ESR; Length: 0.079inch; Width: 0.049inch; Height: 0.026inch; Lead Free: Lead Free; RoHS Compliant: Yes; ComponentLink1URL: https://datasheet.ciiva.com/2470/esr-2470004.pdf?src-supplier=Digi-Key; ComponentLink1Description: https://datasheet.ciiva.com/2470/esr-2470004.pdf?src-supplier=Digi-Key; ComponentLink2URL: https://datasheet.ciiva.com/2470/esr-2470005.pdf?src-supplier=Digi-Key; ComponentLink2Description: https://datasheet.ciiva.com/2470/esr-2470005.pdf?src-supplier=Digi-Key; ComponentLink3URL: https://datasheet.ciiva.com/2470/esr-2470003.pdf?src-supplier=Digi-Key; ComponentLink3Description: https://datasheet.ciiva.com/2470/esr-2470003.pdf?src-supplier=Digi-Key
R52 R59 R62 R516 R523 = ESR10EZPF1002: Res Thick Film 0805 10K Ohm 1% 0.4W ±100ppm/C Pad SMD Automotive T/R; Manufacturer: Rohm; Resistance: 10kR; Max Power Dissipation: 400mW; Temperature Coefficient: 100ppm/°C; Supplier 1: Mouser; Manufacturer Part Number: ESR10EZPF1002; RoHS: Yes; Category: Chip SMD Resistors; Stock 1: 82018; Pricing 1: 1=0,18000, 10=0,15300, 50=0,15300, 100=0,06000, 1000=0,02600, 2500=0,02300, 5000=0,02000, 10000=0,02000 (USD); Case/Package: 0805; Case Code (Metric): 2012; Case Code (Imperial): 0805; Min Operating Temperature: -55°C; Max Operating Temperature: 155°C; Package Quantity: 1; Tolerance: 1%; Packaging: Tape and Reel; Resistor Type: Thick Film; Number of Terminations: 2; Features: Automotive AEC-Q200; Series: ESR; Length: 0.079inch; Width: 0.049inch; Height: 0.026inch; RoHS Compliant: Yes; ComponentLink1URL: https://datasheet.ciiva.com/2469/esr-2469862.pdf?src-supplier=Digi-Key; ComponentLink1Description: https://datasheet.ciiva.com/2469/esr-2469862.pdf?src-supplier=Digi-Key; ComponentLink2URL: https://datasheet.ciiva.com/2469/esr-2469863.pdf?src-supplier=Digi-Key; ComponentLink2Description: https://datasheet.ciiva.com/2469/esr-2469863.pdf?src-supplier=Digi-Key; ComponentLink3URL: https://datasheet.ciiva.com/2469/esr-2469864.pdf?src-supplier=Digi-Key; ComponentLink3Description: https://datasheet.ciiva.com/2469/esr-2469864.pdf?src-supplier=Digi-Key
R53 R510 R517 R524 = ESR10EZPF1003: Res Thick Film 0805 100K Ohm 1% 0.4W ±100ppm/C Epoxy Resin Pad SMD Automotive T/R; Manufacturer: Rohm; Resistance: 100kR; Temperature Coefficient: 100ppm/°C; Power Rating: 400mW; Working Voltage: 150V; Supplier 1: Mouser; Manufacturer Part Number: ESR10EZPF1003; RoHS: Yes; Category: Chip SMD Resistors; Stock 1: 66757; Pricing 1: 1=0,18000, 10=0,15300, 50=0,15300, 100=0,06000, 1000=0,02600, 10000=0,02000 (USD); Case/Package: 0805; Case Code (Metric): 2012; Case Code (Imperial): 0805; Min Operating Temperature: -55°C; Max Operating Temperature: 155°C; Tolerance: 1%; Packaging: Tape and Reel; Resistor Type: Thick Film; Package Quantity: 1; Number of Terminations: 2; Max Power Dissipation: 400mW; Features: Automotive AEC-Q200; Series: ESR; Technology: THICK FILM; Length: 0.079inch; Width: 0.049inch; Height: 0.026inch; Lead Free: Lead Free; RoHS Compliant: Yes; ComponentLink1URL: https://datasheet.ciiva.com/2498/esr-2498617.pdf?src-supplier=Digi-Key; ComponentLink1Description: https://datasheet.ciiva.com/2498/esr-2498617.pdf?src-supplier=Digi-Key; ComponentLink2URL: https://datasheet.ciiva.com/2498/esr-2498618.pdf?src-supplier=Digi-Key; ComponentLink2Description: https://datasheet.ciiva.com/2498/esr-2498618.pdf?src-supplier=Digi-Key; ComponentLink3URL: https://datasheet.ciiva.com/2498/esr-2498619.pdf?src-supplier=Digi-Key; ComponentLink3Description: https://datasheet.ciiva.com/2498/esr-2498619.pdf?src-supplier=Digi-Key
R57 R514 R521 R528 = ESR10EZPJ821: Res Thick Film 0805 820 Ohm 5% 0.4W ±200ppm/C Epoxy Resin Pad SMD Automotive T/R; Manufacturer: Rohm; Resistance: 820R; Power Rating: 250mW; Max Power Dissipation: 400mW; Temperature Coefficient: 200ppm/°C; Supplier 1: Mouser; Manufacturer Part Number: ESR10EZPJ821; RoHS: Yes; Category: Chip SMD Resistors; Stock 1: 2887; Pricing 1: 1=0,10000, 10=0,08600, 50=0,08600, 100=0,03300, 1000=0,01500, 10000=0,01100 (USD); Case/Package: 0805; Case Code (Metric): 2012; Case Code (Imperial): 0805; Size Code: 0805; Min Operating Temperature: -55°C; Max Operating Temperature: 155°C; Package Quantity: 1; Tolerance: 5%; Packaging: Tape and Reel; Resistor Type: Thick Film; Number of Terminations: 2; Features: Automotive AEC-Q200; Series: ESR; Length: 0.079inch; Width: 0.049inch; Height: 0.026inch; Lead Free: Lead Free; RoHS Compliant: Yes; ComponentLink1URL: https://datasheet.ciiva.com/2469/esr-2469639.pdf?src-supplier=Digi-Key; ComponentLink1Description: https://datasheet.ciiva.com/2469/esr-2469639.pdf?src-supplier=Digi-Key; ComponentLink2URL: https://datasheet.ciiva.com/2469/esr-2469640.pdf?src-supplier=Digi-Key; ComponentLink2Description: https://datasheet.ciiva.com/2469/esr-2469640.pdf?src-supplier=Digi-Key; ComponentLink3URL: https://datasheet.ciiva.com/2469/esr-2469641.pdf?src-supplier=Digi-Key; ComponentLink3Description: https://datasheet.ciiva.com/2469/esr-2469641.pdf?src-supplier=Digi-Key; ComponentLink4URL: https://datasheet.ciiva.com/16508/esr10ezpd-16508527.pdf?src-supplier=Future+Electronics; ComponentLink4Description: https://datasheet.ciiva.com/16508/esr10ezpd-16508527.pdf?src-supplier=Future+Electronics
R61 = KTR10EZPF5232: Res High Voltage 0805 52.3K Ohm 1/8W 1% SMD; Manufacturer: Rohm; Resistance: 52.3kR; Max Power Dissipation: 125mW; Temperature Coefficient: 100ppm/°C; Supplier 1: Mouser; Manufacturer Part Number: KTR10EZPF5232; RoHS: Yes; Category: Chip SMD Resistors; Stock 1: 7499; Pricing 1: 1=0,19000, 10=0,16700, 50=0,16700, 100=0,06600, 1000=0,02800, 10000=0,02200 (USD); Case/Package: 0805; Case Code (Metric): 2012; Case Code (Imperial): 0805; Min Operating Temperature: -55°C; Max Operating Temperature: 155°C; Package Quantity: 5000; Tolerance: 1%; Packaging: Cut Tape; Resistor Type: Thick Film; Number of Terminations: 2; Features: Automotive AEC-Q200; Series: KTR; Length: 0.079inch; Width: 0.049inch; Height: 0.026inch; RoHS Compliant: Yes; ComponentLink1URL: https://datasheet.ciiva.com/14926/ktr-14926604.pdf?src-supplier=Digi-Key; ComponentLink1Description: https://datasheet.ciiva.com/14926/ktr-14926604.pdf?src-supplier=Digi-Key
U21 U22 = TC4051BFTELN: Analog Multiplexer Single 8: 1 16-Pin TSSOP T/R; Manufacturer: Toshiba; Logic Function: Multiplexer,Demultiplexer; On-State Resistance: 160R; Number of Circuits: 1; -3db Bandwidth: 20MHz; Supplier 1: Mouser; Manufacturer Part Number: TC4051BFTELN; RoHS: Yes; Category: Interface ICs; Stock 1: 1960; Pricing 1: 1=0,59000, 10=0,50200, 50=0,50200, 100=0,34800, 500=0,29400, 1000=0,22800, 2000=0,20700, 4000=0,19300, 10000=0,18200, 24000=0,17600 (USD); Mount: Surface Mount; Case/Package: TSSOP; Number of Pins: 16; Min Operating Temperature: -40°C; Max Operating Temperature: 85°C; Package Quantity: 1; Packaging: Tape and Reel; Supply Type: Single; ComponentLink1URL: https://datasheet.ciiva.com/45263/tc4051bft-datasheet-en-20140301-45263118.pdf?src-supplier=Digi-Key; ComponentLink1Description: https://datasheet.ciiva.com/45263/tc4051bft-datasheet-en-20140301-45263118.pdf?src-supplier=Digi-Key; ComponentLink2URL: https://datasheet.ciiva.com/45263/tc4051bft-datasheet-en-20140301-45263117.pdf?src-supplier=Digi-Key; ComponentLink2Description: https://datasheet.ciiva.com/45263/tc4051bft-datasheet-en-20140301-45263117.pdf?src-supplier=Digi-Key; ComponentLink3URL: https://datasheet.ciiva.com/45423/tc4051bft-datasheet-en-20140301-45423126.pdf?src-supplier=Digi-Key; ComponentLink3Description: https://datasheet.ciiva.com/45423/tc4051bft-datasheet-en-20140301-45423126.pdf?src-supplier=Digi-Key; ComponentLink4URL: https://datasheet.ciiva.com/45423/tc4051bft-datasheet-en-20140301-45423125.pdf?src-supplier=Digi-Key; ComponentLink4Description: https://datasheet.ciiva.com/45423/tc4051bft-datasheet-en-20140301-45423125.pdf?src-supplier=Digi-Key
U23 U24 = SN74LV1T02DBVRG4: Single Power Supply 2-input POSITIVE NOR GATE Logic Level Shifter 5-SOT-23 -40 to 125; Manufacturer: Texas Instruments; Number of Bits: 1; Number of Inputs: 2; Quiescent Current: 10uA; High Level Output Current: 8mA; Propagation Delay: 7ns; Supplier 1: Mouser; Manufacturer Part Number: SN74LV1T02DBVRG4; RoHS: Yes; Category: Logic Gates; Stock 1: 2805; Pricing 1: 1=0,56000, 10=0,47800, 50=0,47800, 100=0,33100, 500=0,28000, 1000=0,21700, 3000=0,19700, 6000=0,18400, 10000=0,18400 (USD); Mount: Surface Mount; Case/Package: SOT-23-5; Min Operating Temperature: -40°C; Max Operating Temperature: 125°C; Logic Function: NOR GATE; Packaging: Cut Tape; Number of Circuits: 1; Low Level Output Current: 8mA; RoHS Compliant: Yes; ComponentLink1URL: http://www.ti.com/lit/ds/symlink/sn74lv1t02.pdf?src-supplier=Digi-Key; ComponentLink1Description: http://www.ti.com/lit/ds/symlink/sn74lv1t02.pdf?src-supplier=Digi-Key; ComponentLink2URL: http://www.ti.com/general/docs/suppproductinfo.tsp?distId=10&amp;gotoUrl=http%3A%2F%2Fwww.ti.com%2Flit%2Fgpn%2Fsn74lv1t02&src-supplier=Digi-Key; ComponentLink2Description: http://www.ti.com/general/docs/suppproductinfo.tsp?distId=10&amp;gotoUrl=http%3A%2F%2Fwww.ti.com%2Flit%2Fgpn%2Fsn74lv1t02&src-supplier=Digi-Key
U31 = ADC101C027CIMK/NOPB: 10-Bit, 189kSPS, 1-Ch SAR ADC with I2C 6-SOT-23-THIN -40 to 105; Manufacturer: TI National Semiconductor; Number of Channels: 1; Max Power Dissipation: 5.8mW; Resolution: 10b; Number of Bits: 10; Sampling Rate: 188.9KS/s; Polarity: Unipolar; Supply Type: Single; Signal to Noise Ratio (SNR): 61.8dB; Full Scale Error: 1LSB; Differential Nonlinearity: 0.7LSB; Min Supply Voltage: 2.7V; Max Supply Voltage: 5.5V; Operating Supply Voltage: 5V; Input Type: SINGLE-ENDED; Nominal Supply Current: 740uA; Supplier 1: Mouser; Manufacturer Part Number: ADC101C027CIMK/NOPB; RoHS: Yes; Category: Analog to Digital Converters (ADCs); Stock 1: 34; Pricing 1: 1=1,85000, 10=1,67000, 50=1,58000, 100=1,35000, 1000=0,91300, 10000=0,91300 (USD); Mount: Surface Mount; Case/Package: TSOT; Number of Pins: 6; Contact Plating: Tin; Min Operating Temperature: -40°C; Max Operating Temperature: 105°C; Interface: I2C; Package Quantity: 1000; Packaging: Tape and Reel; Number of Converters: 1; Number of A/D Converters: 1; Number of Analog Inputs: 1; Conversion Rate: 188.9KS/s; Integral Nonlinearity (INL): 0.7LSB; Number of Inputs: 1; Series: PowerWise®; Radiation Hardening: No; Lead Free: Lead Free; RoHS Compliant: Yes; ComponentLink1URL: https://datasheet.ciiva.com/15147/getdatasheetpartid-158992-15147832.pdf?src-supplier=Verical; ComponentLink1Description: https://datasheet.ciiva.com/15147/getdatasheetpartid-158992-15147832.pdf?src-supplier=Verical; ComponentLink2URL: https://datasheet.ciiva.com/41460/001186638-da-01-en-ic-adc-adc101c027cimk-nopb-tsot-23-6-tid-41460910.pdf?src-supplier=Conrad; ComponentLink2Description: https://datasheet.ciiva.com/41460/001186638-da-01-en-ic-adc-adc101c027cimk-nopb-tsot-23-6-tid-41460910.pdf?src-supplier=Conrad; ComponentLink3URL: https://datasheet.ciiva.com/1501/91285-1501814.pdf?src-supplier=Farnell; ComponentLink3Description: https://datasheet.ciiva.com/1501/91285-1501814.pdf?src-supplier=Farnell; Number of Elements: 1; Length: 2.97mm; Width: 1.65mm; Height: 0.87mm; REACH SVHC: No SVHC; ComponentLink4URL: https://datasheet.ciiva.com/7988/1853638-7988909.pdf?src-supplier=Element14; ComponentLink4Description: https://datasheet.ciiva.com/7988/1853638-7988909.pdf?src-supplier=Element14; ComponentLink5URL: https://datasheet.ciiva.com/14259/adc101c027-14259487.pdf?src-supplier=Avnet; ComponentLink5Description: https://datasheet.ciiva.com/14259/adc101c027-14259487.pdf?src-supplier=Avnet
U61 = AP62301WU-7: Converter DC to DC 4.2V to 18V Synchronous Step Down Single-Out 3A 6-Pin TSOT-26 T/R; Manufacturer: Diodes; Supplier 1: Mouser; Manufacturer Part Number: AP62301WU-7; RoHS: Yes; Category: Voltage Regulators - Switching; Stock 1: 159264; Pricing 1: 1=0,49000, 10=0,41600, 50=0,41600, 100=0,28800, 500=0,24400, 1000=0,18900, 3000=0,17100, 10000=0,17100 (USD)